# Altium schematic sheet IceZUM_Core_HX1K.SchDoc: Top Sheet
size A3; Author: Eladio Delgado; CompanyName: bq - Mundo Reader; Organization: bq - Mundo Reader; Revision: 0; SheetNumber: 0; SheetTotal: 5
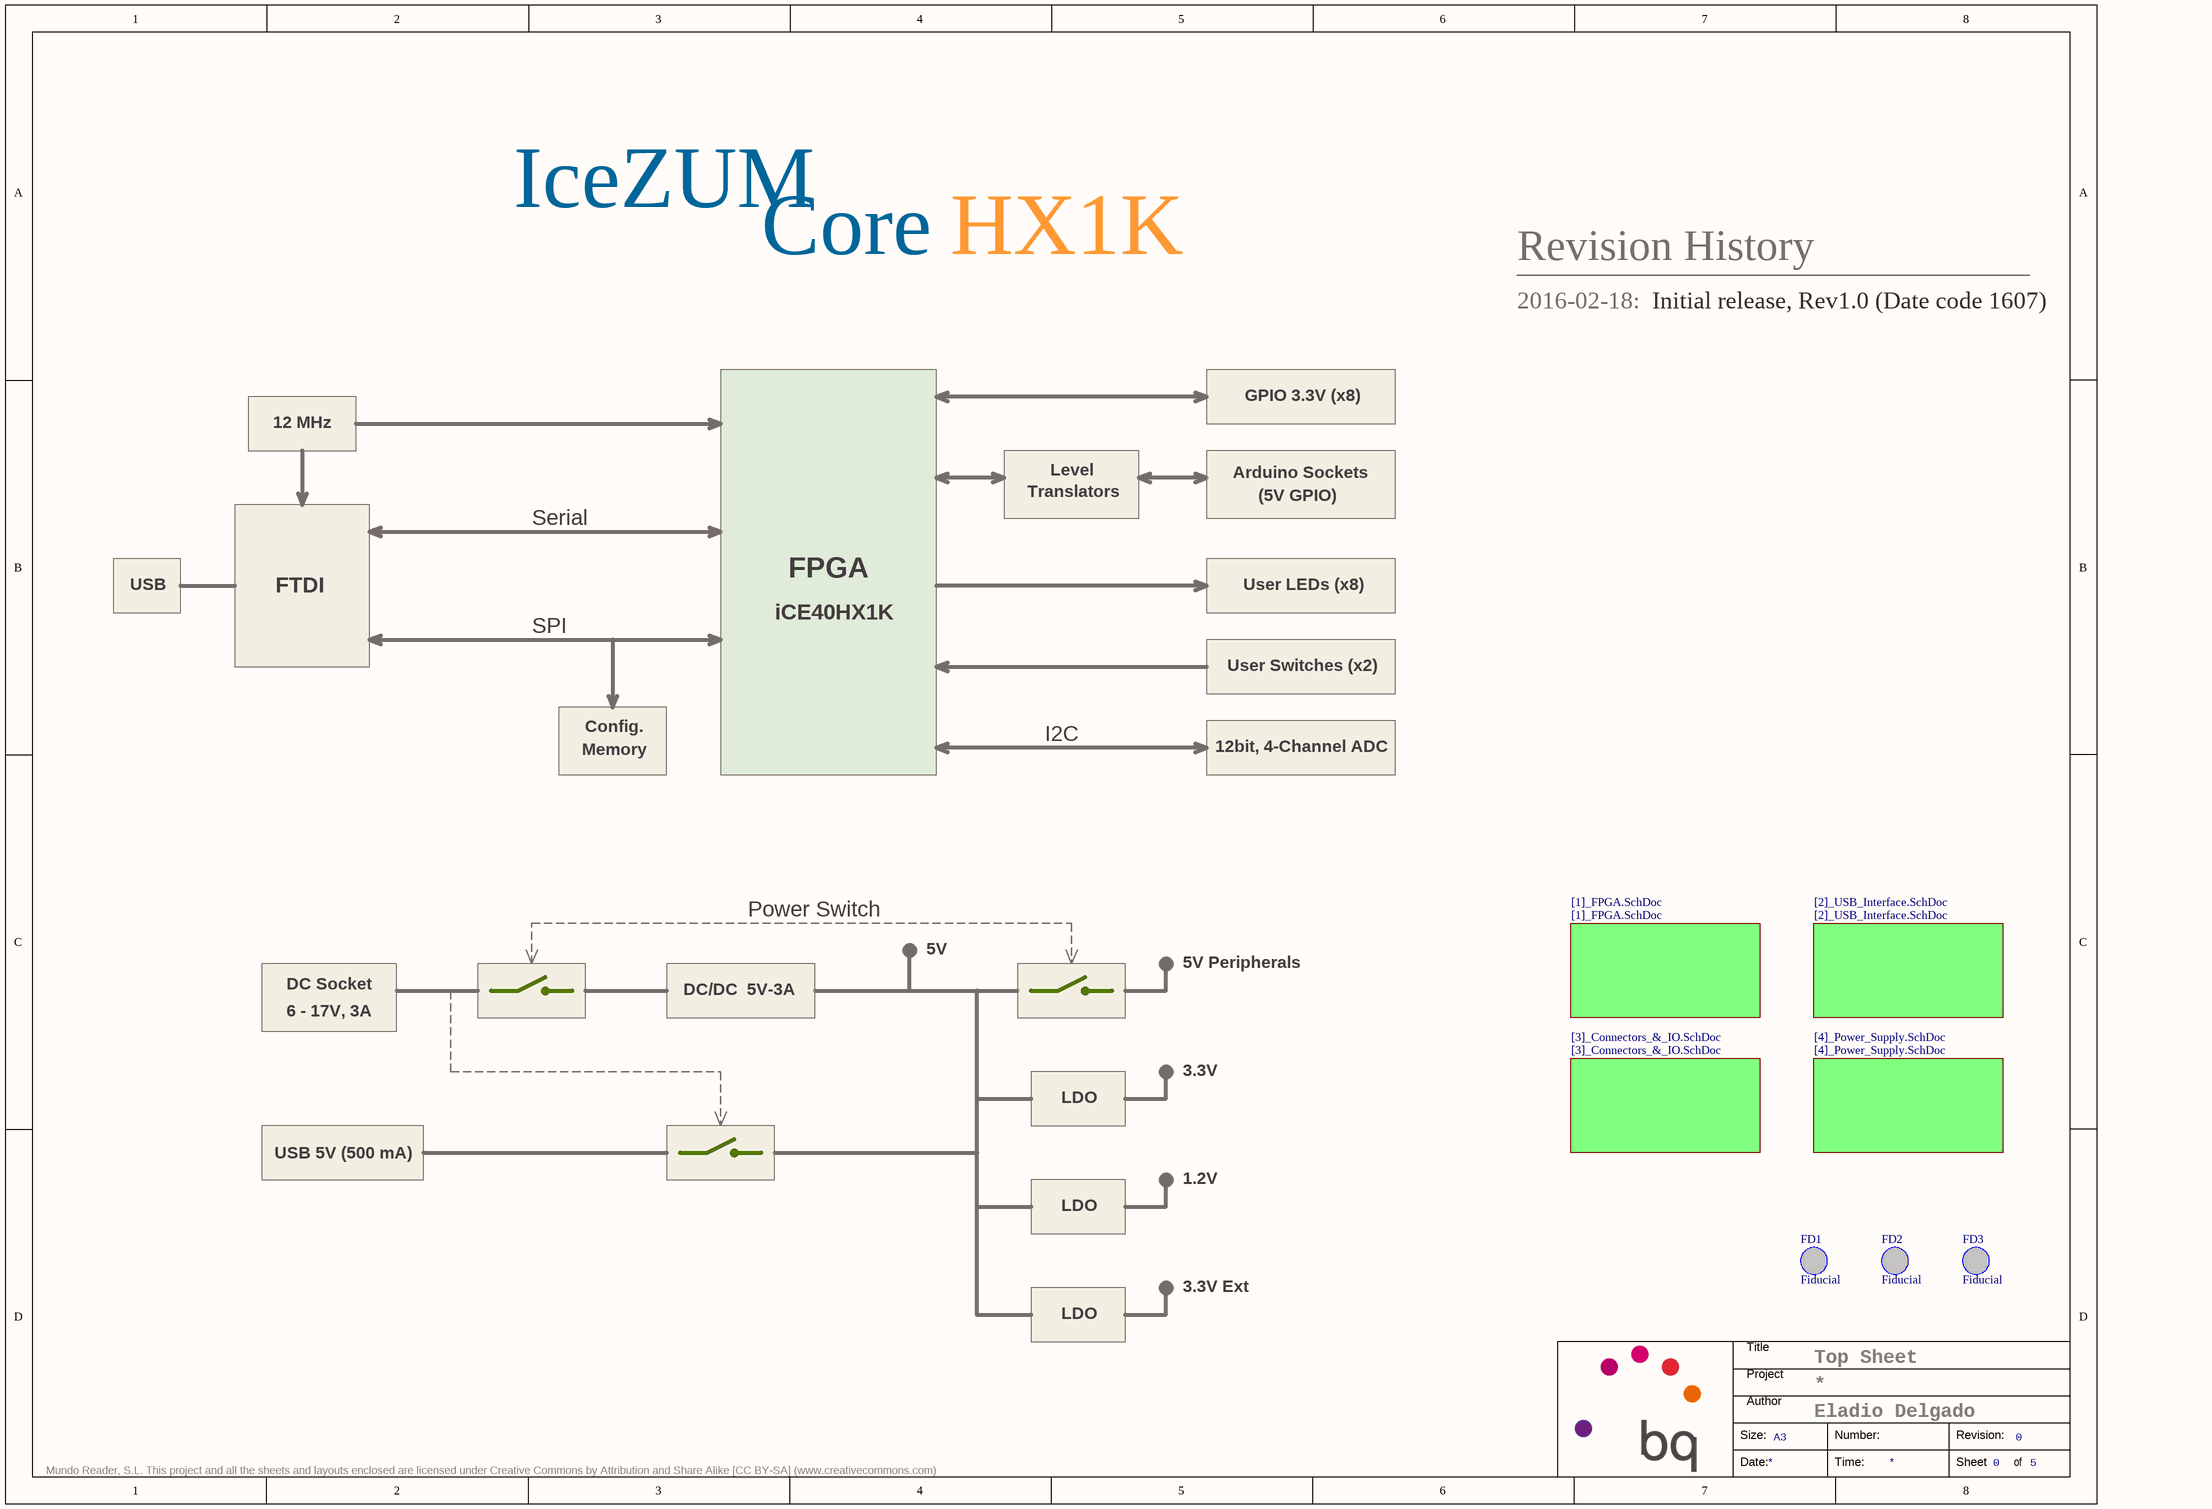
[diagram p0: IceZUM_Core_HX1K.SchDoc]

## Parts
FD1  Fiducial  [Fiducial]  (no BOM)
FD2  Fiducial  [Fiducial]  (no BOM)
FD3  Fiducial  [Fiducial]  (no BOM)

## Sub-sheets
[1]_FPGA.SchDoc = [1]_FPGA.SchDoc: no entries
[2]_USB_Interface.SchDoc = [2]_USB_Interface.SchDoc: no entries
[3]_Connectors_&_IO.SchDoc = [3]_Connectors_&_IO.SchDoc: no entries
[4]_Power_Supply.SchDoc = [4]_Power_Supply.SchDoc: no entries

## Notes on the sheet
- IceZUM
- Core
- HX1K
- Revision History
- 2016-02-18:
- Initial release, Rev1.0 (Date code 1607)
- 12 MHz
- GPIO 3.3V (x8)
- Translators
- Level
- Arduino Sockets
- (5V GPIO)
- Serial
- FPGA
- USB
- FTDI
- SPI
- iCE40HX1K
- User LEDs (x8)
- User Switches (x2)
- Memory
- Config.
- I2C
- 12bit, 4-Channel ADC
- Power Switch
- DC Socket
- 5V
- 5V Peripherals
- 6 - 17V, 3A
- DC/DC  5V-3A
- LDO
- 3.3V
- USB 5V (500 mA)
- 1.2V
- 3.3V Ext
- Title
- Project
- Size:
- Author
- A3
- Number:
- Revision:
- Mundo Reader, S.L. This project and all the sheets and layouts enclosed are licensed under Creative Commons by Attribution and Share Alike [CC BY-SA] (www.creativecommons.com)
- Date:
- Time:
- Sheet
- of

## Library data of the parts
FD1-FD3 = Fiducial: Part Number: Fiducial